# EAGLE schematic PokeyMax4s (EAGLE 6.6.0)

## Sheet 1 of 7: IO
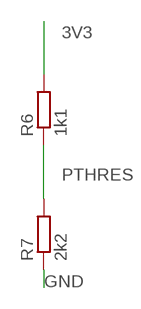
[diagram p0: schematic, sheet 1]

### Parts
R6  1k1  R-EU_R0402  [R0402]
R7  2k2  R-EU_R0402  [R0402]

### Nets
3V3: R6.2 ; also sheet 2,3,4,6
GND: R7.1 ; also sheet 2,3,4,5,6,7
PTHRES: R6.1 R7.2 ; also sheet 2

## Sheet 2 of 7: FPGA
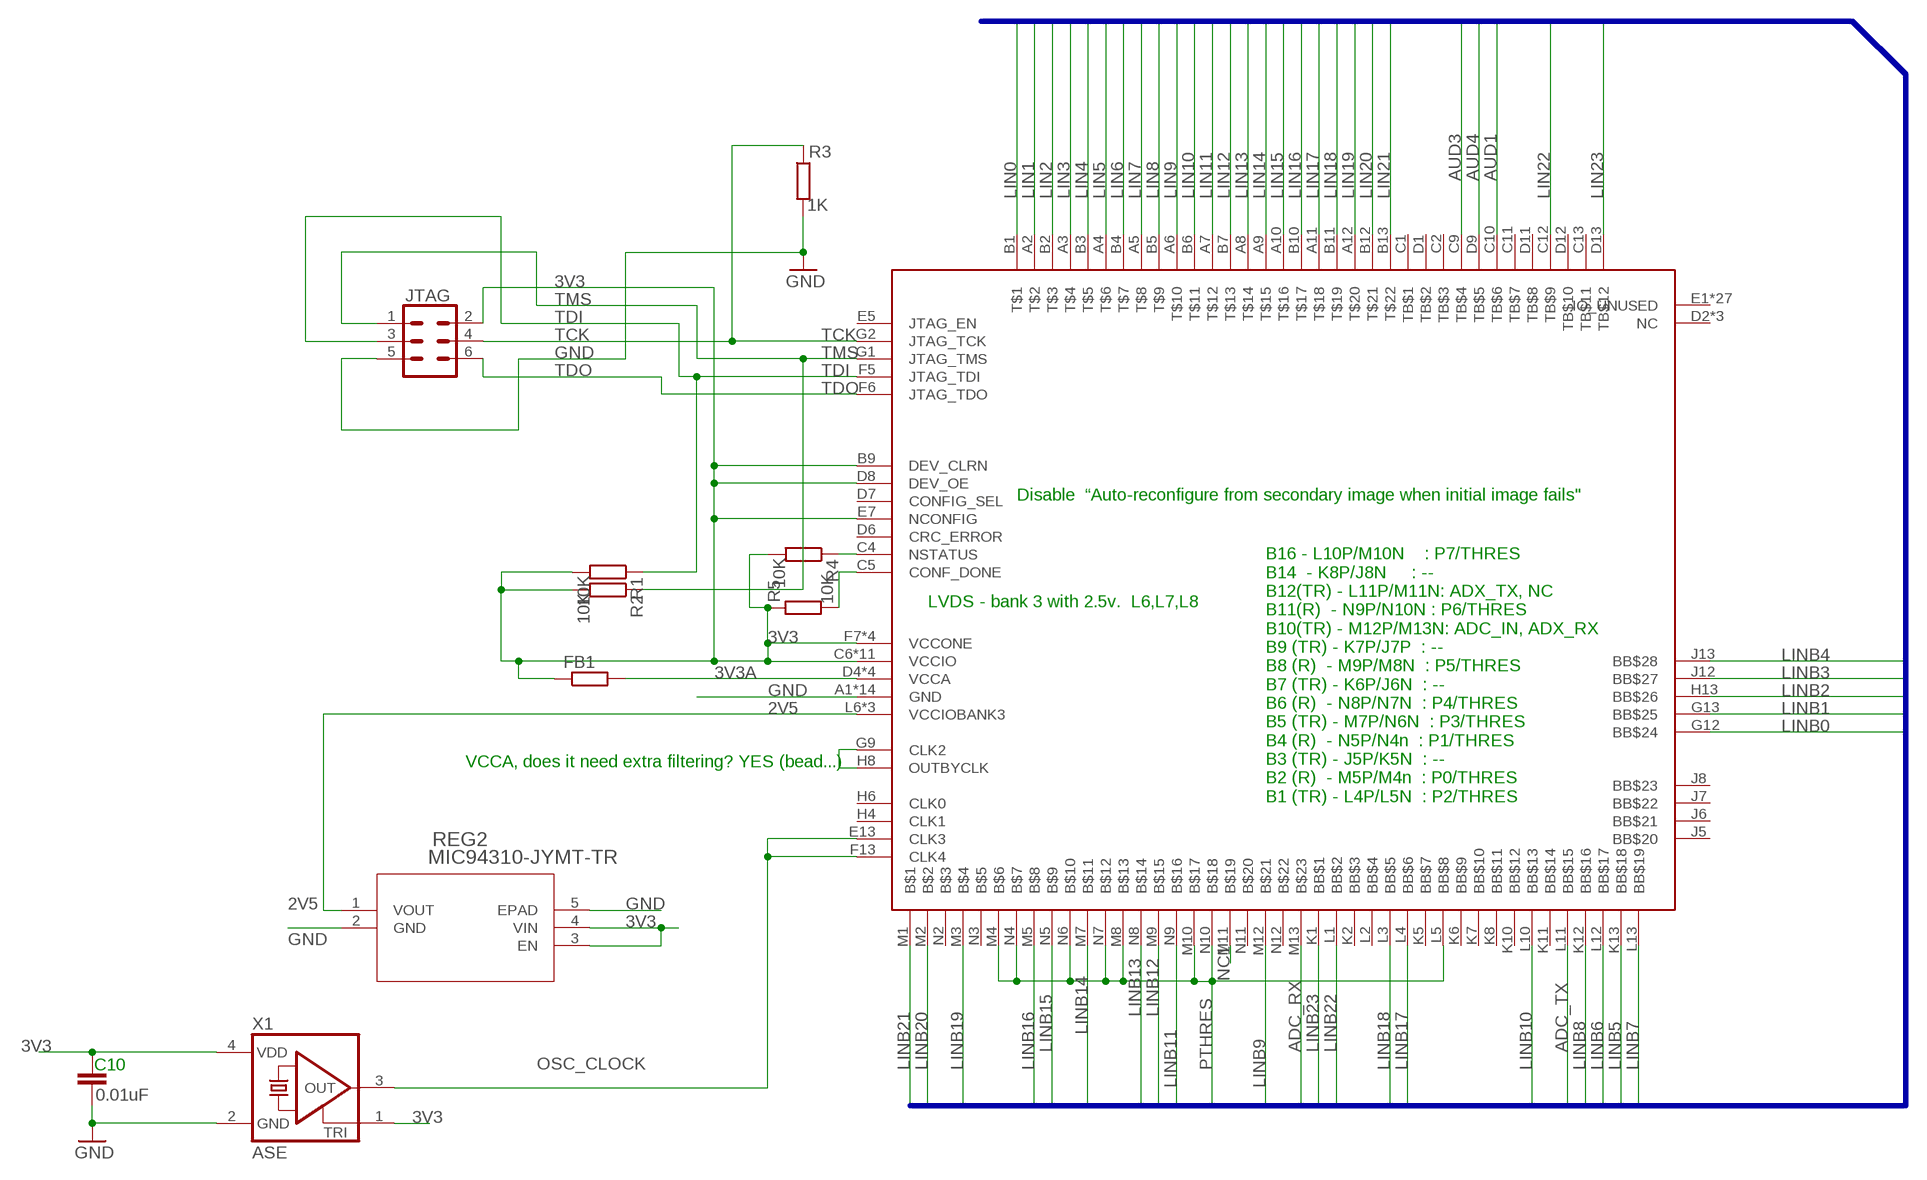
[diagram p1: schematic, sheet 2]

### Parts
C10  0.01uF  C-EUC0402  [C0402]
FB1  R-EU_R0402  [R0402]
JTAG  CONN_03X2LOCK  [2X3_LOCK]
R1  10K  R-EU_R0402  [R0402]
R2  10K  R-EU_R0402  [R0402]
R3  1K  R-EU_R0402  [R0402]
R4  10K  R-EU_R0402  [R0402]
R5  10K  R-EU_R0402  [R0402]
REG2  MIC94310-JYMT-TR  [TDFN4_1P2X1P6_MCH]
U3  MAX10  [U169SMALL]
X1  ASE  [ASE]

### Nets
2V5: REG2.1(VOUT) U3.L6(VCCIOBANK3) U3.L7(VCCIOBANK3) U3.L8(VCCIOBANK3) ; also sheet 6,7
3V3: C10.1 FB1.1 JTAG.2 R1.2 R2.2 R4.2 R5.1 REG2.3(EN) REG2.4(VIN) U3.B9(DEV_CLRN) U3.C6(VCCIO) U3.C7(VCCIO) U3.C8(VCCIO) U3.D8(DEV_OE) U3.E7(NCONFIG) U3.F2(VCCIO) U3.F7(VCCONE) U3.F11(VCCIO) U3.G3(VCCIO) U3.G6(VCCONE) U3.G8(VCCONE) U3.G11(VCCIO) U3.H7(VCCONE) U3.H11(VCCIO) U3.J3(VCCIO) U3.J11(VCCIO) U3.K3(VCCIO) X1.1(TRI) X1.4(VDD) ; also sheet 1,3,4,6
3V3A: FB1.2 U3.D4(VCCA) U3.D10(VCCA) U3.K4(VCCA) U3.K9(VCCA) ; also sheet 6
ADC_RX: U3.M13(B$23) ; also sheet 7
ADC_TX: U3.L11(BB$15) ; also sheet 7
AUD1: U3.C10(TB$6) ; also sheet 5
AUD3: U3.C9(TB$4) ; also sheet 5
AUD4: U3.D9(TB$5) ; also sheet 5
CONF_DONE: R5.2 U3.C5(CONF_DONE)
FAKE_CLK: U3.G9(CLK2) U3.H8(OUTBYCLK)
GND: C10.2 JTAG.5 R3.2 REG2.2(GND) REG2.5(EPAD) U3.A1(GND) U3.A13(GND) U3.B8(GND) U3.C3(GND) U3.D5(GND) U3.E11(GND) U3.F3(GND) U3.G7(GND) U3.H12(GND) U3.J4(GND) U3.L9(GND) U3.M6(GND) U3.N1(GND) U3.N13(GND) X1.2(GND) ; also sheet 1,3,4,5,6,7
LIN0: U3.B1(T$1) ; also sheet 3
LIN1: U3.A2(T$2) ; also sheet 3
LIN2: U3.B2(T$3) ; also sheet 3
LIN3: U3.A3(T$4) ; also sheet 3
LIN4: U3.B3(T$5) ; also sheet 3
LIN5: U3.A4(T$6) ; also sheet 3
LIN6: U3.B4(T$7) ; also sheet 3
LIN7: U3.A5(T$8) ; also sheet 3
LIN8: U3.B5(T$9) ; also sheet 3
LIN9: U3.A6(T$10) ; also sheet 3
LIN10: U3.B6(T$11) ; also sheet 3
LIN11: U3.A7(T$12) ; also sheet 3
LIN12: U3.B7(T$13) ; also sheet 3
LIN13: U3.A8(T$14) ; also sheet 3
LIN14: U3.A9(T$15) ; also sheet 3
LIN15: U3.A10(T$16) ; also sheet 3
LIN16: U3.B10(T$17) ; also sheet 3
LIN17: U3.A11(T$18) ; also sheet 3
LIN18: U3.B11(T$19) ; also sheet 3
LIN19: U3.A12(T$20) ; also sheet 3
LIN20: U3.B12(T$21) ; also sheet 3
LIN21: U3.B13(T$22) ; also sheet 3
LIN22: U3.C12(TB$9) ; also sheet 3
LIN23: U3.D13(TB$12) ; also sheet 3
LINB0: U3.G12(BB$24) ; also sheet 3
LINB1: U3.G13(BB$25) ; also sheet 3
LINB2: U3.H13(BB$26) ; also sheet 3
LINB3: U3.J12(BB$27) ; also sheet 3
LINB4: U3.J13(BB$28) ; also sheet 3
LINB5: U3.K13(BB$18) ; also sheet 3
LINB6: U3.L12(BB$17) ; also sheet 3
LINB7: U3.L13(BB$19) ; also sheet 3
LINB8: U3.K12(BB$16) ; also sheet 3
LINB9: U3.M12(B$21) ; also sheet 3,7
LINB10: U3.L10(BB$13) ; also sheet 3
LINB11: U3.N9(B$16) ; also sheet 3
LINB12: U3.M9(B$15) ; also sheet 3
LINB13: U3.N8(B$14) ; also sheet 3
LINB14: U3.M7(B$11) ; also sheet 3
LINB15: U3.N5(B$9) ; also sheet 3
LINB16: U3.M5(B$8) ; also sheet 3
LINB17: U3.L4(BB$6) ; also sheet 3
LINB18: U3.L3(BB$5) ; also sheet 3
LINB19: U3.M3(B$4) ; also sheet 3
LINB20: U3.M2(B$2) ; also sheet 3
LINB21: U3.M1(B$1) ; also sheet 3
LINB22: U3.L1(BB$2) ; also sheet 3
LINB23: U3.K1(BB$1) ; also sheet 3
NC1: U3.M11(B$19)
NSTATUS: R4.1 U3.C4(NSTATUS)
OSC_CLOCK: U3.E13(CLK3) U3.F13(CLK4) X1.3(OUT)
PTHRES: U3.L5(BB$8) U3.M4(B$6) U3.M8(B$13) U3.M10(B$17) U3.N4(B$7) U3.N6(B$10) U3.N7(B$12) U3.N10(B$18) ; also sheet 1
TCK: JTAG.4 R3.1 U3.G2(JTAG_TCK)
TDI: JTAG.3 R1.1 U3.F5(JTAG_TDI)
TDO: JTAG.6 U3.F6(JTAG_TDO)
TMS: JTAG.1 R2.1 U3.G1(JTAG_TMS)
Unconnected: U3.C1(TB$1) U3.C2(TB$3) U3.C11(TB$7) U3.C13(TB$11) U3.D1(TB$2) U3.D2(NC) U3.D3(NC) U3.D6(CRC_ERROR) U3.D7(CONFIG_SEL) U3.D11(TB$8) U3.D12(TB$10) U3.E1(IO_UNUSED) U3.E2(NC) U3.E3(IO_UNUSED) U3.E4(IO_UNUSED) U3.E5(JTAG_EN) U3.E6(IO_UNUSED) U3.E8(IO_UNUSED) U3.E9(IO_UNUSED) U3.E10(IO_UNUSED) U3.E12(IO_UNUSED) U3.F1(IO_UNUSED) U3.F4(IO_UNUSED) U3.F8(IO_UNUSED) U3.F9(IO_UNUSED) U3.F10(IO_UNUSED) U3.F12(IO_UNUSED) U3.G4(IO_UNUSED) U3.G5(IO_UNUSED) U3.G10(IO_UNUSED) U3.H1(IO_UNUSED) U3.H2(IO_UNUSED) U3.H3(IO_UNUSED) U3.H4(CLK1) U3.H5(IO_UNUSED) U3.H6(CLK0) U3.H9(IO_UNUSED) U3.H10(IO_UNUSED) U3.J1(IO_UNUSED) U3.J2(IO_UNUSED) U3.J5(BB$20) U3.J6(BB$21) U3.J7(BB$22) U3.J8(BB$23) U3.J9(IO_UNUSED) U3.J10(IO_UNUSED) U3.K2(BB$3) U3.K5(BB$7) U3.K6(BB$9) U3.K7(BB$10) U3.K8(BB$11) U3.K10(BB$12) U3.K11(BB$14) U3.L2(BB$4) U3.N2(B$3) U3.N3(B$5) U3.N11(B$20) U3.N12(B$22)

### Buses
LINB[0..23],LIN[0..23],AUD[1..4],POTM[0..7],PTHRES,ADC_RX,ADC_TX

### Notes on the sheet
- Disable  “Auto-reconfigure from secondary image when initial image fails"
- LVDS - bank 3 with 2.5v.  L6,L7,L8
- VCCA, does it need extra filtering? YES (bead...)
- B16 - L10P/M10N    : P7/THRES
  B14  - K8P/J8N     : --
  B12(TR) - L11P/M11N: ADX_TX, NC
  B11(R)  - N9P/N10N : P6/THRES
  B10(TR) - M12P/M13N: ADC_IN, ADX_RX
  B9 (TR) - K7P/J7P  : --
  B8 (R)  - M9P/M8N  : P5/THRES
  B7 (TR) - K6P/J6N  : --
  B6 (R)  - N8P/N7N  : P4/THRES
  B5 (TR) - M7P/N6N  : P3/THRES
  B4 (R)  - N5P/N4n  : P1/THRES
  B3 (TR) - J5P/K5N  : --
  B2 (R)  - M5P/M4n  : P0/THRES
  B1 (TR) - L4P/L5N  : P2/THRES

## Sheet 3 of 7: Level conv
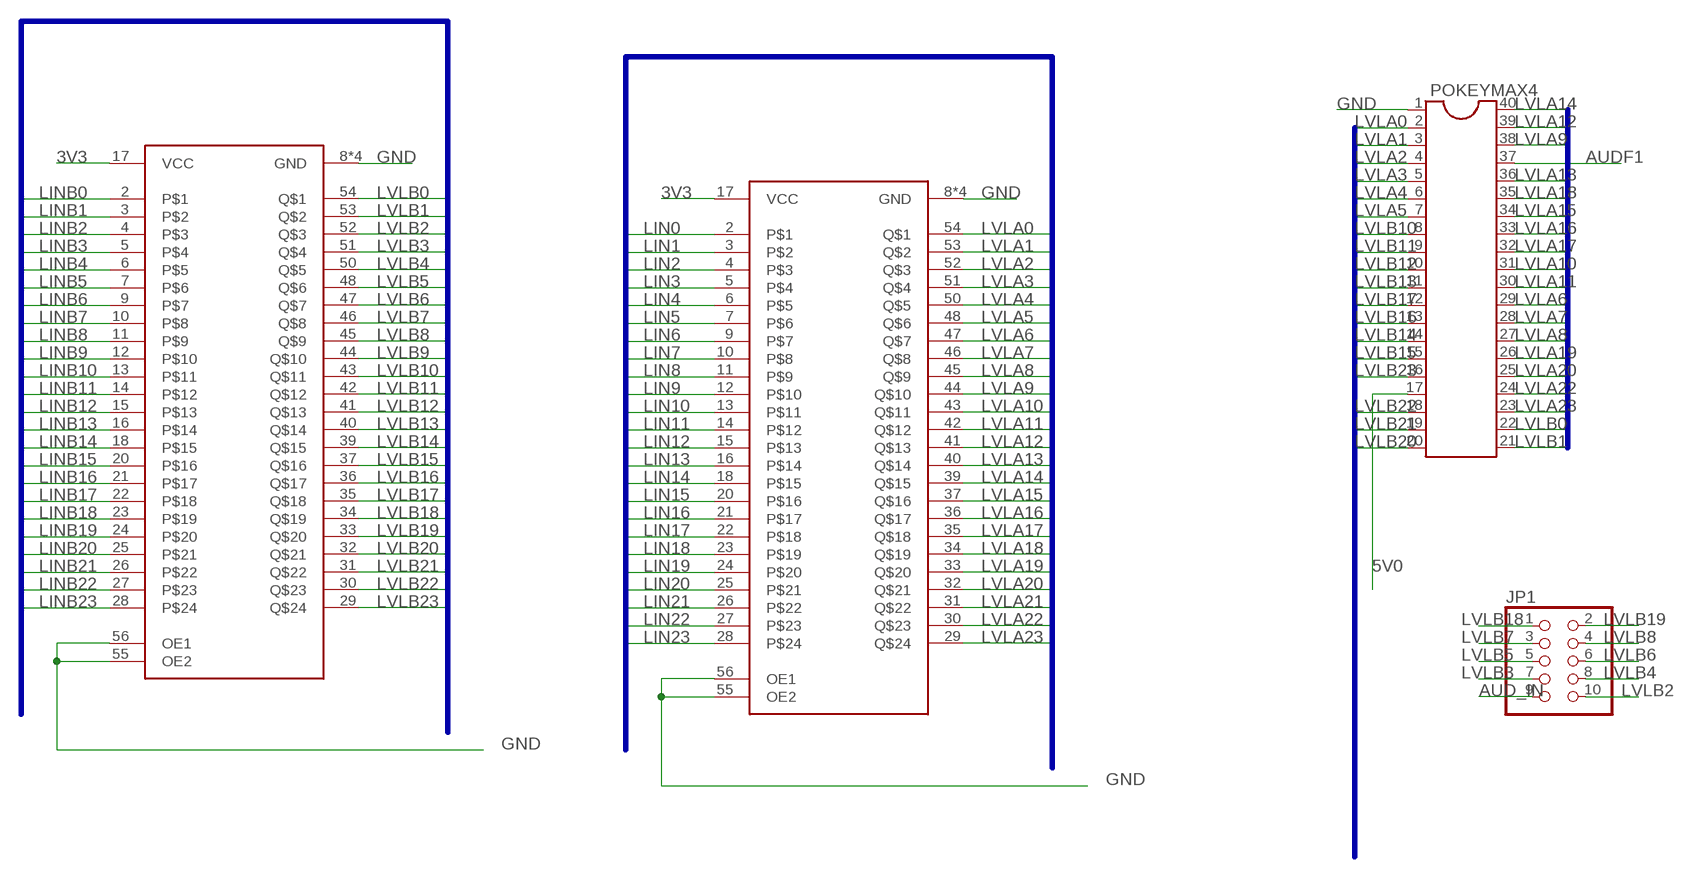
[diagram p2: schematic, sheet 3]

### Parts
JP1  PINHD-2X5  [2X05]
POKEYMAX4  DIL40  [DIL40]
U2  SN74CB3T16211SM  [56TVSOP_SMALL]
U4  SN74CB3T16211SM  [56TVSOP_SMALL]

### Nets
3V3: U2.17(VCC) U4.17(VCC) ; also sheet 1,2,4,6
5V0: POKEYMAX4.17 ; also sheet 4,5,6
AUD_IN: JP1.9 ; also sheet 7
AUDF1: POKEYMAX4.37 ; also sheet 5
GND: POKEYMAX4.1 U2.8(GND) U2.19(GND) U2.38(GND) U2.49(GND) U2.55(OE2) U2.56(OE1) U4.8(GND) U4.19(GND) U4.38(GND) U4.49(GND) U4.55(OE2) U4.56(OE1) ; also sheet 1,2,4,5,6,7
LIN0: U2.2 ; also sheet 2
LIN1: U2.3 ; also sheet 2
LIN2: U2.4 ; also sheet 2
LIN3: U2.5 ; also sheet 2
LIN4: U2.6 ; also sheet 2
LIN5: U2.7 ; also sheet 2
LIN6: U2.9 ; also sheet 2
LIN7: U2.10 ; also sheet 2
LIN8: U2.11 ; also sheet 2
LIN9: U2.12 ; also sheet 2
LIN10: U2.13 ; also sheet 2
LIN11: U2.14 ; also sheet 2
LIN12: U2.15 ; also sheet 2
LIN13: U2.16 ; also sheet 2
LIN14: U2.18 ; also sheet 2
LIN15: U2.20 ; also sheet 2
LIN16: U2.21 ; also sheet 2
LIN17: U2.22 ; also sheet 2
LIN18: U2.23 ; also sheet 2
LIN19: U2.24 ; also sheet 2
LIN20: U2.25 ; also sheet 2
LIN21: U2.26 ; also sheet 2
LIN22: U2.27 ; also sheet 2
LIN23: U2.28 ; also sheet 2
LINB0: U4.2 ; also sheet 2
LINB1: U4.3 ; also sheet 2
LINB2: U4.4 ; also sheet 2
LINB3: U4.5 ; also sheet 2
LINB4: U4.6 ; also sheet 2
LINB5: U4.7 ; also sheet 2
LINB6: U4.9 ; also sheet 2
LINB7: U4.10 ; also sheet 2
LINB8: U4.11 ; also sheet 2
LINB9: U4.12 ; also sheet 2,7
LINB10: U4.13 ; also sheet 2
LINB11: U4.14 ; also sheet 2
LINB12: U4.15 ; also sheet 2
LINB13: U4.16 ; also sheet 2
LINB14: U4.18 ; also sheet 2
LINB15: U4.20 ; also sheet 2
LINB16: U4.21 ; also sheet 2
LINB17: U4.22 ; also sheet 2
LINB18: U4.23 ; also sheet 2
LINB19: U4.24 ; also sheet 2
LINB20: U4.25 ; also sheet 2
LINB21: U4.26 ; also sheet 2
LINB22: U4.27 ; also sheet 2
LINB23: U4.28 ; also sheet 2
LVLA0: POKEYMAX4.2 U2.54(Q$1)
LVLA1: POKEYMAX4.3 U2.53(Q$2)
LVLA2: POKEYMAX4.4 U2.52(Q$3)
LVLA3: POKEYMAX4.5 U2.51(Q$4)
LVLA4: POKEYMAX4.6 U2.50(Q$5)
LVLA5: POKEYMAX4.7 U2.48(Q$6)
LVLA6: POKEYMAX4.29 U2.47(Q$7)
LVLA7: POKEYMAX4.28 U2.46(Q$8)
LVLA8: POKEYMAX4.27 U2.45(Q$9)
LVLA9: POKEYMAX4.38 U2.44(Q$10)
LVLA10: POKEYMAX4.31 U2.43(Q$11)
LVLA11: POKEYMAX4.30 U2.42(Q$12)
LVLA12: POKEYMAX4.39 U2.41(Q$13)
LVLA13: POKEYMAX4.36 U2.40(Q$14)
LVLA14: POKEYMAX4.40 U2.39(Q$15)
LVLA15: POKEYMAX4.34 U2.37(Q$16)
LVLA16: POKEYMAX4.33 U2.36(Q$17)
LVLA17: POKEYMAX4.32 U2.35(Q$18)
LVLA18: POKEYMAX4.35 U2.34(Q$19)
LVLA19: POKEYMAX4.26 U2.33(Q$20)
LVLA20: POKEYMAX4.25 U2.32(Q$21)
LVLA21: U2.31(Q$22) ; also sheet 5
LVLA22: POKEYMAX4.24 U2.30(Q$23)
LVLA23: POKEYMAX4.23 U2.29(Q$24)
LVLB0: POKEYMAX4.22 U4.54(Q$1)
LVLB1: POKEYMAX4.21 U4.53(Q$2)
LVLB2: JP1.10 U4.52(Q$3)
LVLB3: JP1.7 U4.51(Q$4)
LVLB4: JP1.8 U4.50(Q$5)
LVLB5: JP1.5 U4.48(Q$6)
LVLB6: JP1.6 U4.47(Q$7)
LVLB7: JP1.3 U4.46(Q$8)
LVLB8: JP1.4 U4.45(Q$9)
LVLB9: U4.44(Q$10) ; also sheet 7
LVLB10: POKEYMAX4.8 U4.43(Q$11)
LVLB11: POKEYMAX4.9 U4.42(Q$12)
LVLB12: POKEYMAX4.10 U4.41(Q$13)
LVLB13: POKEYMAX4.11 U4.40(Q$14)
LVLB14: POKEYMAX4.14 U4.39(Q$15)
LVLB15: POKEYMAX4.15 U4.37(Q$16)
LVLB16: POKEYMAX4.13 U4.36(Q$17)
LVLB17: POKEYMAX4.12 U4.35(Q$18)
LVLB18: JP1.1 U4.34(Q$19)
LVLB19: JP1.2 U4.33(Q$20)
LVLB20: POKEYMAX4.20 U4.32(Q$21)
LVLB21: POKEYMAX4.19 U4.31(Q$22)
LVLB22: POKEYMAX4.18 U4.30(Q$23)
LVLB23: POKEYMAX4.16 U4.29(Q$24)

### Buses
LINB[0..23],LVLB[0..23]
LVLA[0..23],LVLB[0..7],KR[1..2],K[0..5]
LVLA[0..23],LVLB[0..23],POT[0..7],POTCH[0..7],KR[1..2],K[0..5]
LIN[0..23],LVLA[0..23]

## Sheet 4 of 7: Power regs
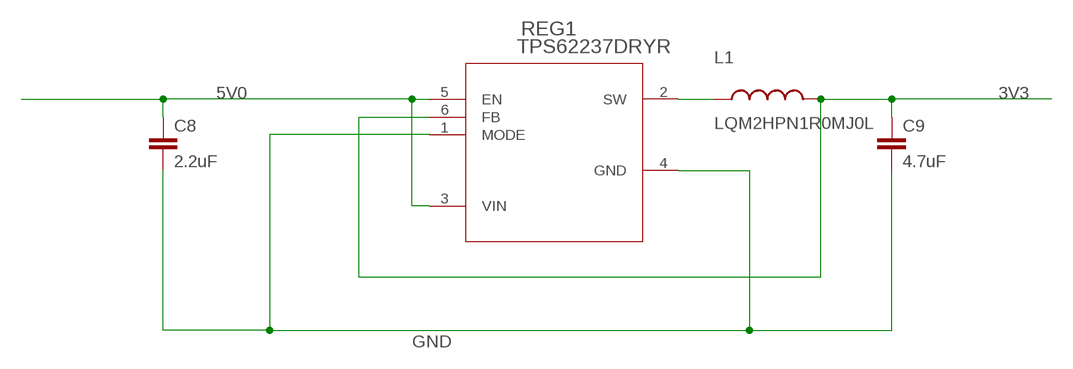
[diagram p3: schematic, sheet 4]

### Parts
C8  2.2uF  C-EUC0402  [C0402]
C9  4.7uF  C-EUC0402  [C0402]
L1  LQM2HPN1R0MJ0L  [INDC1008X04]
REG1  TPS62237DRYR  [DRY6]

### Nets
3V3: C9.1 L1.2 REG1.6(FB) ; also sheet 1,2,3,6
5V0: C8.1 REG1.3(VIN) REG1.5(EN) ; also sheet 3,5,6
GND: C8.2 C9.2 REG1.1(MODE) REG1.4(GND) ; also sheet 1,2,3,5,6,7
N$137: L1.1 REG1.2(SW)

## Sheet 5 of 7: Audio filter
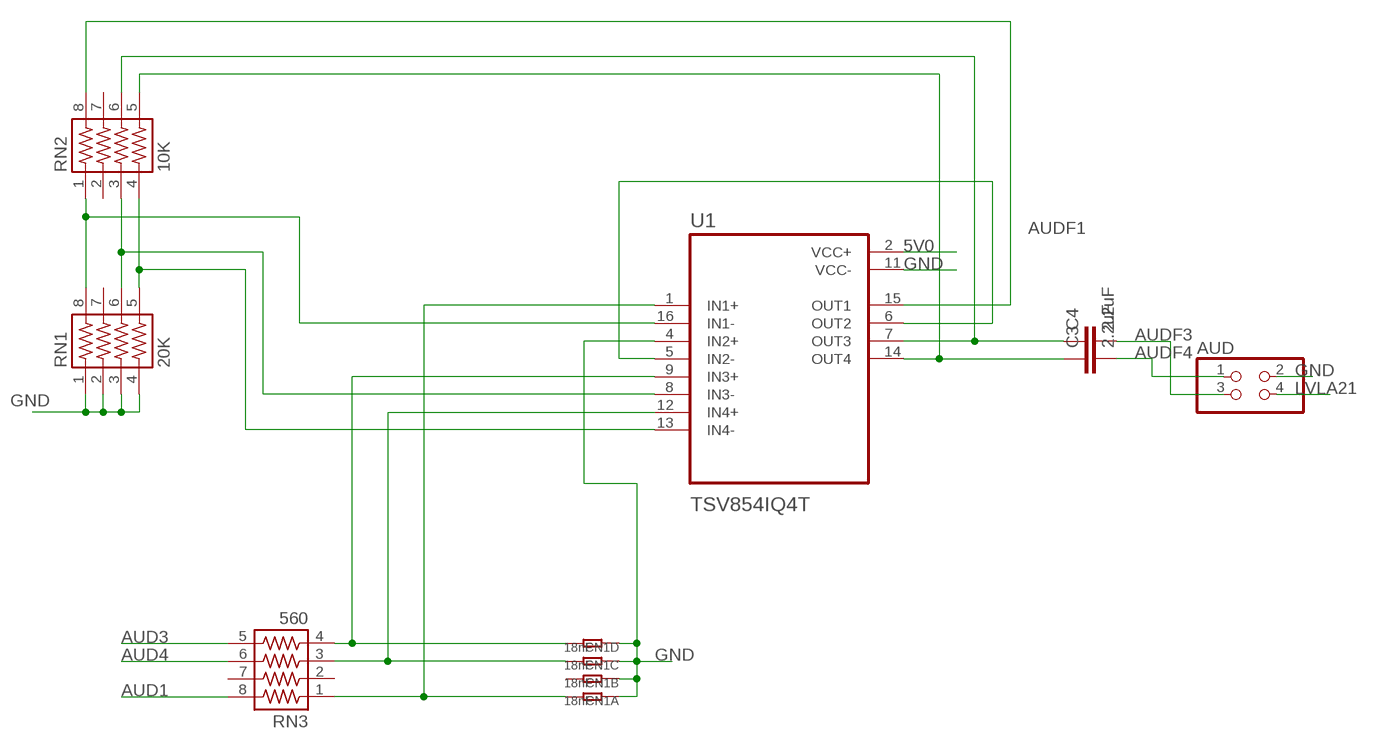
[diagram p4: schematic, sheet 5]

### Parts
AUD  PINHD-2X2  [2X02]
C3  2.2uF  C-EUC0402  [C0402]
C4  2.2uF  C-EUC0402  [C0402]
CN1  18nF  R-4R  [R1206-8]
RN1  20K  741-8  [741-8]
RN2  10K  741-8  [741-8]
RN3  560  741-8  [741-8]
U1  TSV854IQ4T  [QFN50P300X300X100-16N]

### Nets
5V0: U1.2(VCC+) ; also sheet 3,4,6
AMPIN1M: RN1.8 RN2.1 U1.16(IN1-)
AMPIN1P: CN1.8 RN3.1 U1.1(IN1+)
AMPIN3M: RN1.6 RN2.3 U1.8(IN3-)
AMPIN3P: CN1.5 RN3.4 U1.9(IN3+)
AMPIN4P: CN1.6 RN3.3 U1.12(IN4+)
AUD1: RN3.8 ; also sheet 2
AUD3: RN3.5 ; also sheet 2
AUD4: RN3.6 ; also sheet 2
AUDF1: RN2.8 U1.15(OUT1) ; also sheet 3
AUDF2: U1.5(IN2-) U1.6(OUT2)
AUDF3: AUD.3 C4.2
AUDF4: AUD.1 C3.2
GND: AUD.2 CN1.1 CN1.2 CN1.3 CN1.4 RN1.1 RN1.2 RN1.3 RN1.4 U1.4(IN2+) U1.11(VCC-) ; also sheet 1,2,3,4,6,7
LVLA21: AUD.4 ; also sheet 3
N$5: C3.1 RN2.5 U1.14(OUT4)
N$7: C4.1 RN2.6 U1.7(OUT3)
N$22: RN1.5 RN2.4 U1.13(IN4-)
Unconnected: CN1.7 RN1.7 RN2.2 RN2.7 RN3.2 RN3.7

## Sheet 6 of 7: Decoupling
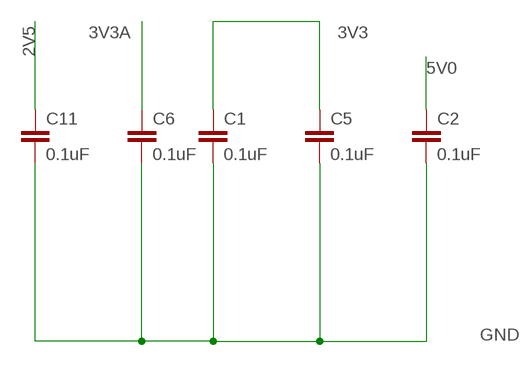
[diagram p5: schematic, sheet 6]

### Parts
C1  0.1uF  C-EUC0402  [C0402]
C2  0.1uF  C-EUC0402  [C0402]
C5  0.1uF  C-EUC0402  [C0402]
C6  0.1uF  C-EUC0402  [C0402]
C11  0.1uF  C-EUC0402  [C0402]

### Nets
2V5: C11.1 ; also sheet 2,7
3V3: C1.1 C5.1 ; also sheet 1,2,3,4
3V3A: C6.1 ; also sheet 2
5V0: C2.1 ; also sheet 3,4,5
GND: C1.2 C2.2 C5.2 C6.2 C11.2 ; also sheet 1,2,3,4,5,7

## Sheet 7 of 7: ADC
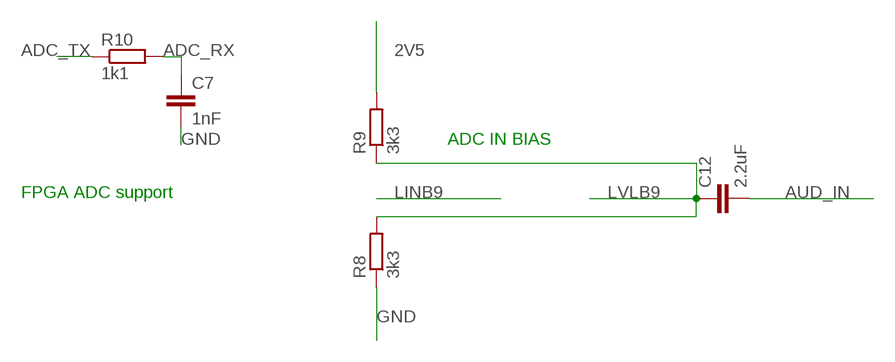
[diagram p6: schematic, sheet 7]

### Parts
C7  1nF  C-EUC0402  [C0402]
C12  2.2uF  C-EUC0402  [C0402]
R8  3k3  R-EU_R0402  [R0402]
R9  3k3  R-EU_R0402  [R0402]
R10  1k1  R-EU_R0402  [R0402]

### Nets
2V5: R9.2 ; also sheet 2,6
ADC_RX: C7.1 R10.2 ; also sheet 2
ADC_TX: R10.1 ; also sheet 2
AUD_IN: C12.2 ; also sheet 3
GND: C7.2 R8.1 ; also sheet 1,2,3,4,5,6
LVLB9: C12.1 R8.2 R9.1 ; also sheet 3

### Notes on the sheet
- ADC IN BIAS
- FPGA ADC support

## Library data of the parts
AUD = pinhead:PINHD-2X2: PIN HEADER
C1-C12 = rcl:C-EU: CAPACITOR, European symbol
CN1 = Discrete:R-4R*: Resistor Array
FB1 R1-R10 = rcl:R-EU_: RESISTOR, European symbol
JP1 = pinhead:PINHD-2X5: PIN HEADER
JTAG = SparkFun-Connectors:CONN_03X2: Multi connection point. Often used as Generic Header-pin footprint for 0.1 inch spaced/style header connections You can populate with any combo of single row headers, but if you'd like an exact match, check these: Header - 2x3 (Male, 0.1") <https://www.sparkfun.com/products/12807> (PRT-12807) Header - 2x3 (Female, 0.1") <https://www.sparkfun.com/products/13010> (PRT-13010) 2x3 Pin Shrouded Header <https://www.sparkfun.com/products/10877> (PRT-10877) On any of the 0.1 inch spaced packages, you can populate with these: Break Away Headers - Straight <https://www.sparkfun.com/products/116> (PRT-00116) Break Away Male Headers - Right Angle <https://www.sparkfun.com/products/553> (PRT-00553) Female Headers <https://www.sparkfun.com/products/115> (PRT-00115) Break Away Headers - Machine Pin <https://www.sparkfun.com/products/117> (PRT-00117) Break Away Female Headers - Swiss Machine Pin <https://www.sparkfun.com/products/743> (PRT-00743) Special note: the shrouded connector mates well with our 3x2 ribbon cables: Ribbon Crimp Connector - 6-pin (2x3, Female) <https://www.sparkfun.com/products/10651> (PRT-10651) Ribbon Cable - 6 wire (15ft) <https://www.sparkfun.com/products/10646> (PRT-10646)
L1 = LQM2HPN1R0MJ0L:LQM2HPN1R0MJ0L: Inductor Power Chip Shielded Multi-Layer 1uH 20% 1MHz Ferrite 1.5A 113mOhm DCR 1008 Embossed T/R; DESCRIPTION: Inductor Power Chip Shielded Multi-Layer 1uH 20% 1MHz Ferrite 1.5A 113mOhm DCR 1008 Embossed T/R; DIGI-KEY_PART_NUMBER: 490-6699-1-ND; DIGI-KEY_PURCHASE_URL: https://www.digikey.com/product-detail/en/murata-electronics-north-america/LQM2HPN1R0MJ0L/490-6699-1-ND/3845896?utm_source=snapeda&utm_medium=aggregator&utm_campaign=symbol; MF: Murata Electronics; MP: LQM2HPN1R0MJ0L; PACKAGE: 1008 Murata
POKEYMAX4 = ic-package:DIL40: Dual In Line
REG1 = max10:TPS62237DRYR; MANUFACTURER_PART_NUMBER: TPS62237DRYR; VENDOR: Texas Instruments
REG2 = max10:MIC94310-JYMT-TR; BUILT_BY: EMA_Jessica; COPYRIGHT: Copyright (C) 2018 Accelerated Designs. All rights reserved; MANUFACTURER_PART_NUMBER: MIC94310-JYMT-TR; SOURCELIBRARY: Microchip_2019-08-23_18; VENDOR: Microchip
RN1-RN3 = resistor-array:741-8: CTS 741 Series 8 Terminations, 4 Resistors
U1 = TSV854IQ4T:TSV854IQ4T: None; AVAILABILITY: Unavailable; DESCRIPTION: General Purpose Amplifier 4 Circuit Rail-to-Rail 16-QFN _3x3_; MF: STMicroelectronics; MP: TSV854IQ4T; PACKAGE: QFN-16 STMicroelectronics; PRICE: None
U2 U4 = max10:SN74CB3T16211
U3 = max10:MAX10
X1 = crystal:ASE: 3.3Vdc CMOS SMD CRYSTAL CLOCK OSCILLATOR SOurce: www.abracon.com; OC_FARNELL: unknown; OC_NEWARK: unknown